# EAGLE schematic 7セグメントカウンタ回路 (EAGLE 9.7.0)
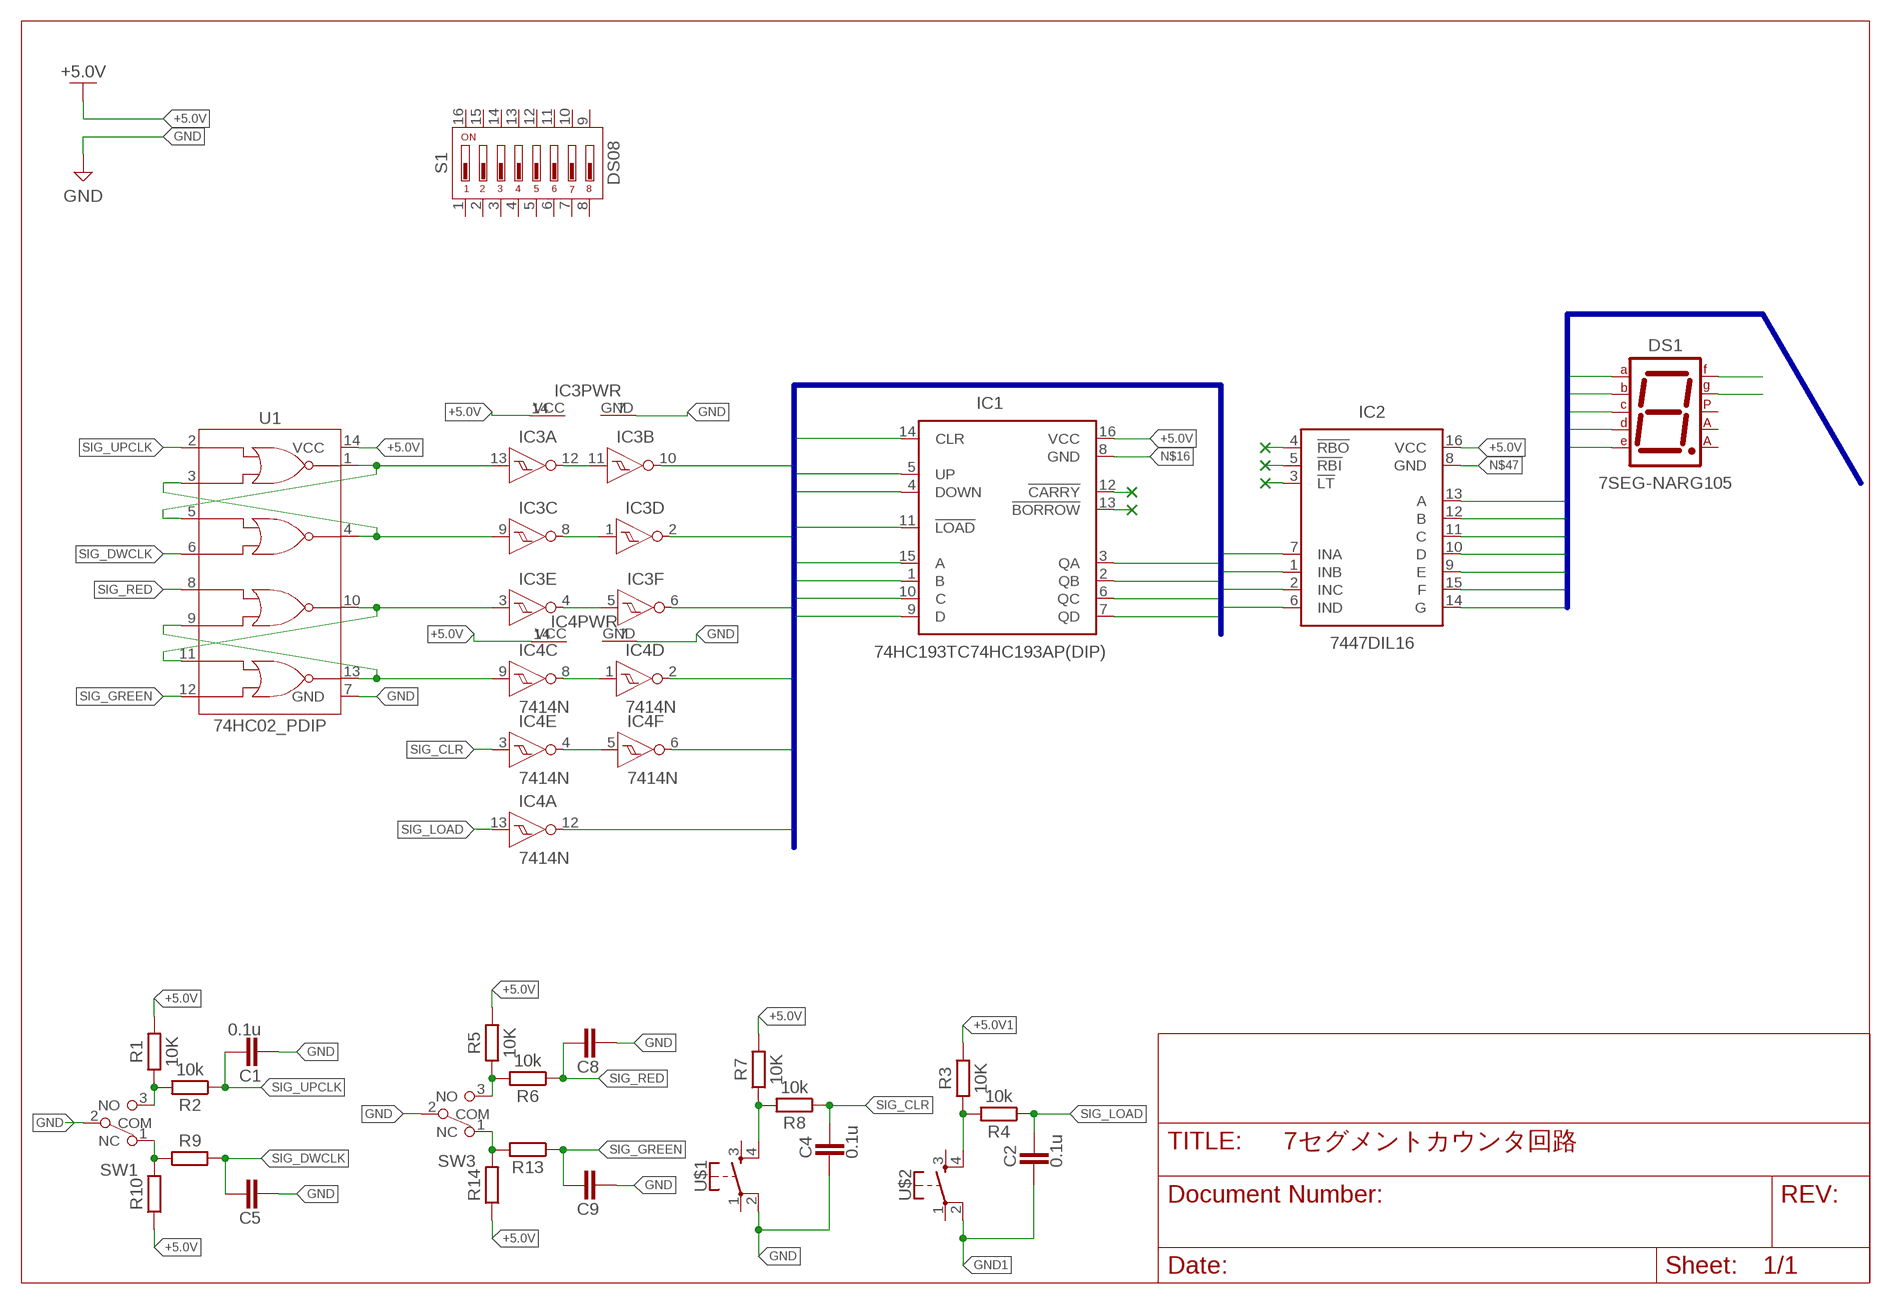
[diagram p0: schematic, sheet 1]

## Parts
C1  0.1u  CAPACITORCERAMIC-2.54MM  [CAP-THRU-2.54MM]
C2  0.1u  CAPACITORCERAMIC-2.54MM  [CAP-THRU-2.54MM]
C4  0.1u  CAPACITORCERAMIC-2.54MM  [CAP-THRU-2.54MM]
C5  CAPACITORCERAMIC-2.54MM  [CAP-THRU-2.54MM]
C8  CAPACITORCERAMIC-2.54MM  [CAP-THRU-2.54MM]
C9  CAPACITORCERAMIC-2.54MM  [CAP-THRU-2.54MM]
DS1  7SEG-NARG105  [7SEG-NARG105]
IC1  74HC193TC74HC193AP(DIP)  [DIL16]
IC2  7447DIL16  [DIL16]
IC3  7414N  [DIL14]
IC4  7414N  [DIL14]
R1  10K  RAXIAL_PITCH300MIL  [AXIAL_PITCH300MIL]
R2  10k  RAXIAL_PITCH300MIL  [AXIAL_PITCH300MIL]
R3  10K  RAXIAL_PITCH300MIL  [AXIAL_PITCH300MIL]
R4  10k  RAXIAL_PITCH300MIL  [AXIAL_PITCH300MIL]
R5  10K  RAXIAL_PITCH300MIL  [AXIAL_PITCH300MIL]
R6  10k  RAXIAL_PITCH300MIL  [AXIAL_PITCH300MIL]
R7  10K  RAXIAL_PITCH300MIL  [AXIAL_PITCH300MIL]
R8  10k  RAXIAL_PITCH300MIL  [AXIAL_PITCH300MIL]
R9  RAXIAL_PITCH300MIL  [AXIAL_PITCH300MIL]
R10  RAXIAL_PITCH300MIL  [AXIAL_PITCH300MIL]
R13  RAXIAL_PITCH300MIL  [AXIAL_PITCH300MIL]
R14  RAXIAL_PITCH300MIL  [AXIAL_PITCH300MIL]
S1  DS08  [DS-08]
SW1  TOGGLE_SWITCHES3P_TOGGLE_SWITCHES_DIP  [TOGGLE_SWITCH]
SW3  TOGGLE_SWITCHES3P_TOGGLE_SWITCHES_DIP  [TOGGLE_SWITCH]
U1  74HC02_PDIP  [DIP762W53P254L1969H508Q14B]
U$1  SWITCH_MOMENTARY  [SWITCH-MOMENTARY-PTH-6.5MM]
U$2  SWITCH_MOMENTARY  [SWITCH-MOMENTARY-PTH-6.5MM]

## Nets
+5.0V: IC1.16(VCC) IC2.16(VCC) IC3.14(PWR:VCC) IC4.14(PWR:VCC) R1.2 R5.2 R7.2 R10.1 R14.1 U1.14(VCC)
+5.0V1: R3.2
B$1: IC1.1(B) IC1.2(QB) IC1.3(QA) IC1.4(DOWN) IC1.5(UP) IC1.6(QC) IC1.7(QD) IC1.9(D) IC1.10(C) IC1.11(!LOAD) IC1.14(CLR) IC1.15(A) IC2.1(INB) IC2.2(INC) IC2.6(IND) IC2.7(INA) IC3.2(D:O) IC3.6(F:O) IC3.10(B:O) IC4.2(D:O) IC4.6(F:O) IC4.12(A:O)
GND: C1.2 C4.2 C5.2 C8.2 C9.2 IC3.7(PWR:GND) IC4.7(PWR:GND) SW1.2(COM) SW3.2(COM) U1.7(GND) U$1.2
GND1: C2.2 U$2.2
N$1: R1.1 R2.2 SW1.3(NO)
N$2: IC3.9(C:I) U1.3(1B) U1.4(2Y)
N$3: IC3.11(B:I) IC3.12(A:O)
N$4: IC3.1(D:I) IC3.8(C:O)
N$5: R5.1 R6.2 SW3.3(NO)
N$6: IC3.13(A:I) U1.1(1Y) U1.5(2A)
N$7: IC4.1(D:I) IC4.8(C:O)
N$8: IC3.4(E:O) IC3.5(F:I)
N$9: R3.1 R4.2 U$2.4
N$11: IC4.9(C:I) U1.9(3B) U1.13(4Y)
N$16: IC1.8(GND)
N$17: IC1.12(!CARRY)
N$19: IC1.13(!BORROW)
N$20: IC4.4(E:O) IC4.5(F:I)
N$33: R7.1 R8.2 U$1.4
N$34: IC2.5(!RBI)
N$35: IC2.3(!LT)
N$40: IC2.14(G)
N$41: IC2.15(F)
N$42: IC2.9(E)
N$43: IC2.10(D)
N$44: IC2.11(C)
N$45: IC2.12(B)
N$46: IC2.13(A)
N$47: IC2.8(GND)
N$48: IC3.3(E:I) U1.10(3Y) U1.11(4A)
N$49: DS1.9(A)
N$50: DS1.8(B)
N$51: DS1.5(C)
N$52: DS1.2(D)
N$53: DS1.1(E)
N$54: DS1.12(F)
N$55: DS1.14(G)
N$59: R9.1 R10.2 SW1.1(NC)
N$61: R13.2 R14.2 SW3.1(NC)
NC: IC2.4(!RBO)
SIG_CLR: C4.1 IC4.3(E:I) R8.1
SIG_DWCLK: C5.1 R9.2 U1.6(2B)
SIG_GREEN: C9.1 R13.1 U1.12(4B)
SIG_LOAD: C2.1 IC4.13(A:I) R4.1
SIG_RED: C8.1 R6.1 U1.8(3A)
SIG_UPCLK: C1.1 R2.1 U1.2(1A)
Unconnected: DS1.4(ACGR) DS1.6(DP) DS1.11(ACRE) IC4.10(B:O) IC4.11(B:I) S1.1 S1.2 S1.3 S1.4 S1.5 S1.6 S1.7 S1.8 S1.9 S1.10 S1.11 S1.12 S1.13 S1.14 S1.15 S1.16 U$1.1 U$1.3 U$2.1 U$2.3

## Buses
IC193バス:B$1
N$40,N$41,N$42,N$43,N$44,N$45,N$46,N$49,N$50,N$51,N$52,N$53,N$54,N$55,N$56,N$57,N$58

## Notes on the sheet
- ×
- ×
- ×
- ×
- ×

## Library data of the parts
C1 C2 C4 C5 C8 C9 = Capacitor:CAPACITOR: Capacitor - Generic
DS1 = 7SEG-NARG105.flbr:7SEG-NARG105: 7-segment DISPLAY single anode, 13 mm
IC1 = 74HC193:74HC193
IC2 = 74series:74*47
IC3 IC4 = 74series:74*14: Hex schmitt trigger Inverter
R1-R10 R13 R14 = resistor:R
S1 = DIP-SW:DS08: DIL/CODE Switch
SW1 SW3 = Toggle_Switches:TOGGLE_SWITCHES
U1 = IC_Logic:74HC02: Quadruple 2-Input NOR Gates Reference Datasheet <https://www.ti.com/lit/ds/schs125d/schs125d.pdf>
U$1 U$2 = Tinkercad:SWITCH_MOMENTARY